# Altium schematic sheet Kalibracija2.SchDoc
size A4
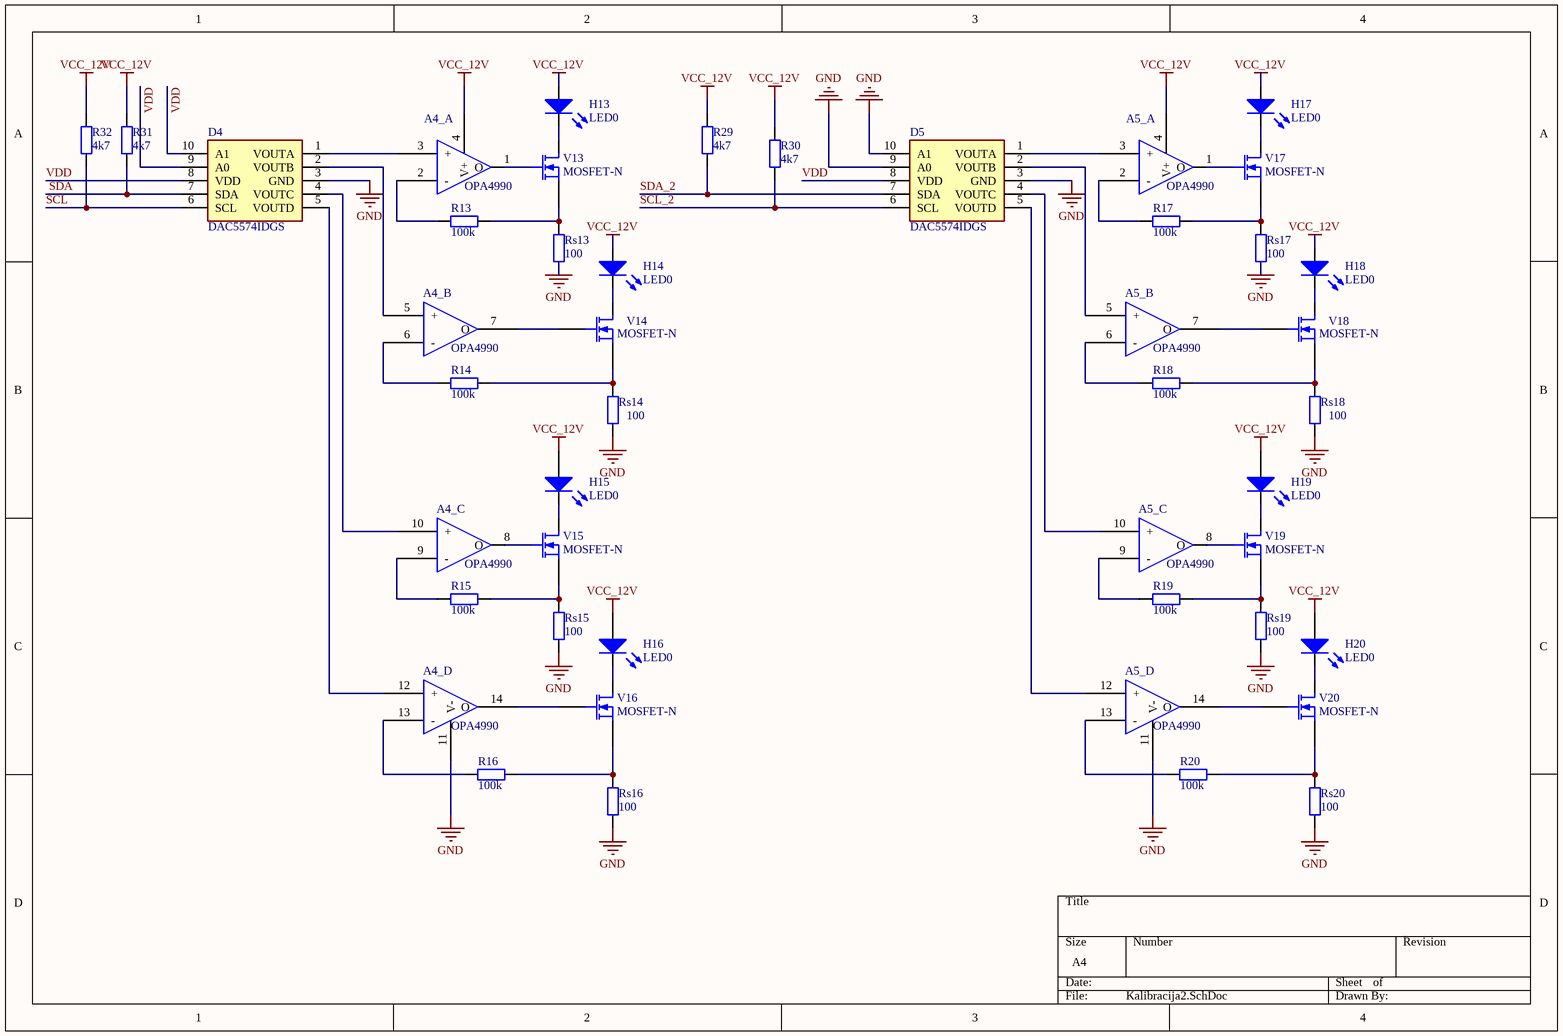
[diagram p0: Kalibracija2.SchDoc]

## Parts
A4_  OPA4990  [SOIC127P600X175-14N]  (parts A,B,C,D of 4)
A5_  OPA4990  [SOIC127P600X175-14N]  (parts A,B,C,D of 4)
D4  DAC5574IDGS  [SOP50P490X110-10N]
D5  DAC5574IDGS  [SOP50P490X110-10N]
H13  LED0  [HDR1X2]
H14  LED0  [HDR1X2]
H15  LED0  [HDR1X2]
H16  LED0  [HDR1X2]
H17  LED0  [HDR1X2]
H18  LED0  [HDR1X2]
H19  LED0  [HDR1X2]
H20  LED0  [HDR1X2]
R13  100k  [AXIAL-0.4]
R14  100k  [AXIAL-0.4]
R15  100k  [AXIAL-0.4]
R16  100k  [AXIAL-0.4]
R17  100k  [AXIAL-0.4]
R18  100k  [AXIAL-0.4]
R19  100k  [AXIAL-0.4]
R20  100k  [AXIAL-0.4]
R29  4k7  [6-0805_N]
R30  4k7  [6-0805_N]
R31  4k7  [6-0805_N]
R32  4k7  [6-0805_N]
Rs13  100  [AXIAL-0.4]
Rs14  100  [AXIAL-0.4]
Rs15  100  [AXIAL-0.4]
Rs16  100  [AXIAL-0.4]
Rs17  100  [AXIAL-0.4]
Rs18  100  [AXIAL-0.4]
Rs19  100  [AXIAL-0.4]
Rs20  100  [AXIAL-0.4]
V13  MOSFET-N  [TO-92]
V14  MOSFET-N  [TO-92]
V15  MOSFET-N  [TO-92]
V16  MOSFET-N  [TO-92]
V17  MOSFET-N  [TO-92]
V18  MOSFET-N  [TO-92]
V19  MOSFET-N  [TO-92]
V20  MOSFET-N  [TO-92]

## Nets
GND: A4_.11(V-) A5_.11(V-) D4.3(GND) D5.3(GND) D5.9(A0) D5.10(A1) Rs13.1 Rs14.1 Rs15.1 Rs16.1 Rs17.1 Rs18.1 Rs19.1 Rs20.1
VCC_12V: A4_.4(V+) A5_.4(V+) H13.1(A) H14.1(A) H15.1(A) H16.1(A) H17.1(A) H18.1(A) H19.1(A) H20.1(A) R29.1 R30.1 R31.1 R32.1
SCL: D4.6(SCL) R32.2
SCL_2: D5.6(SCL) R30.2
SDA: D4.7(SDA) R31.2
SDA_2: D5.7(SDA) R29.2
VDD: D4.8(VDD) D4.9(A0) D4.10(A1) D5.8(VDD)
NetA4__1: A4_.1(O) V13.2(G)
NetA4__2: A4_.2(-) R13.1
NetA4__3: A4_.3(+) D4.1(VOUTA)
NetA4__5: A4_.5(+) D4.2(VOUTB)
NetA4__6: A4_.6(-) R14.1
NetA4__7: A4_.7(O) V14.2(G)
NetA4__8: A4_.8(O) V15.2(G)
NetA4__9: A4_.9(-) R15.1
NetA4__10: A4_.10(+) D4.4(VOUTC)
NetA4__12: A4_.12(+) D4.5(VOUTD)
NetA4__13: A4_.13(-) R16.1
NetA4__14: A4_.14(O) V16.2(G)
NetA5__1: A5_.1(O) V17.2(G)
NetA5__2: A5_.2(-) R17.1
NetA5__3: A5_.3(+) D5.1(VOUTA)
NetA5__5: A5_.5(+) D5.2(VOUTB)
NetA5__6: A5_.6(-) R18.1
NetA5__7: A5_.7(O) V18.2(G)
NetA5__8: A5_.8(O) V19.2(G)
NetA5__9: A5_.9(-) R19.1
NetA5__10: A5_.10(+) D5.4(VOUTC)
NetA5__12: A5_.12(+) D5.5(VOUTD)
NetA5__13: A5_.13(-) R20.1
NetA5__14: A5_.14(O) V20.2(G)
NetH13_2: H13.2(K) V13.1(D)
NetH14_2: H14.2(K) V14.1(D)
NetH15_2: H15.2(K) V15.1(D)
NetH16_2: H16.2(K) V16.1(D)
NetH17_2: H17.2(K) V17.1(D)
NetH18_2: H18.2(K) V18.1(D)
NetH19_2: H19.2(K) V19.1(D)
NetH20_2: H20.2(K) V20.1(D)
NetR13_2: R13.2 Rs13.2 V13.3(S)
NetR14_2: R14.2 Rs14.2 V14.3(S)
NetR15_2: R15.2 Rs15.2 V15.3(S)
NetR16_2: R16.2 Rs16.2 V16.3(S)
NetR17_2: R17.2 Rs17.2 V17.3(S)
NetR18_2: R18.2 Rs18.2 V18.3(S)
NetR19_2: R19.2 Rs19.2 V19.3(S)
NetR20_2: R20.2 Rs20.2 V20.3(S)

## Library data of the parts
D4 D5 = DAC5574IDGS: Integrated Circuit; Manufacturer_Name: Texas Instruments; Datasheet Link: http://www.ti.com/lit/gpn/dac5574; Height: 1.1mm; Manufacturer_Part_Number: DAC5574IDGS; Mouser Part Number: 595-DAC5574IDGS; Mouser Price/Stock: https://www.mouser.com/Search/Refine.aspx?Keyword=595-DAC5574IDGS; RS Part Number: 6621533P; RS Price/Stock: http://uk.rs-online.com/web/p/products/6621533P
H13-H20 = LED0: Typical INFRARED GaAs LED; Published: 8-Jun-2000; LatestRevisionDate: 08-Jul-2005; LatestRevisionNote: Mech Layer 1 removed.; PackageReference: LED-0; Publisher: Altium Limited; PackageDescription: LED; 2 Leads
R13-R20 R29-R32 Rs13-Rs20 = Res2: Resistor; Value: 1K; Published: 8-Jun-2000; LatestRevisionDate: 17-Jul-2002; LatestRevisionNote: Re-released for DXP Platform.; PackageReference: AXIAL-0.4; Publisher: Altium Limited; PackageDescription: Axial Device, Thru-Hole; 2 Leads; 0.4 in Pin Spacing
V13-V20 = MOSFET-N: N-Channel MOSFET; Published: 8-Jun-2000; LatestRevisionDate: 17-Jul-2002; LatestRevisionNote: Re-released for DXP Platform.; PackageVersion: 1995/1996; PackageReference: E3; Publisher: Altium Limited; PackageDescription: TO, Flat Index; 3 In-Line, Axial Leads; Body Dia. 4.6mm; Lead Dia. 0.5 mm (max)